# Altium schematic sheet AC-DC_Converter_Box.SchDoc
size Letter; DocumentNumber: 1; SheetNumber: 1; SheetTotal: 1
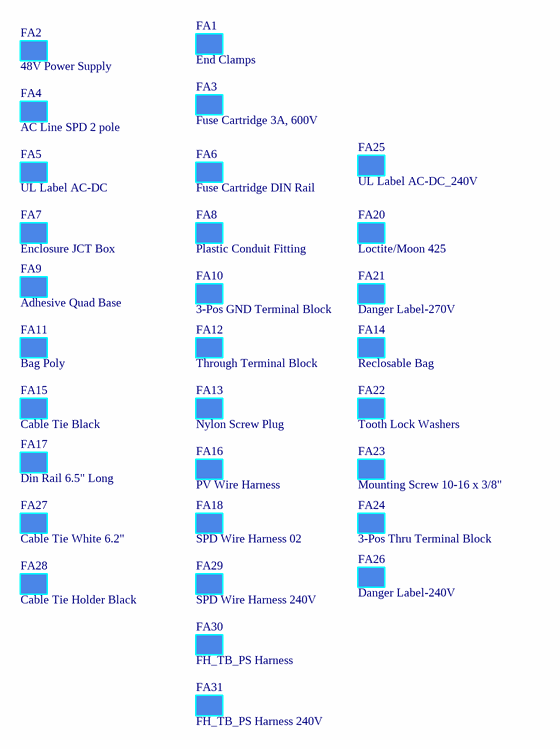
[diagram p0: AC-DC_Converter_Box.SchDoc]

## Parts
FA1  End Clamps  (mechanical)
FA2  48V Power Supply  (mechanical)
FA3  Fuse Cartridge 3A, 600V
FA4  AC Line SPD 2 pole  (mechanical)
FA5  UL Label AC-DC  (mechanical)
FA6  Fuse Cartridge DIN Rail
FA7  Enclosure JCT Box  (mechanical)
FA8  Plastic Conduit Fitting  (mechanical)
FA9  Adhesive Quad Base  (mechanical)
FA10  3-Pos GND Terminal Block  (mechanical)
FA11  Bag Poly  (mechanical)
FA12  Through Terminal Block  (mechanical)
FA13  Nylon Screw Plug
FA14  Reclosable Bag
FA15  Cable Tie Black
FA16  PV Wire Harness  (mechanical)
FA17  Din Rail 6.5" Long  (mechanical)
FA18  SPD Wire Harness 02  (mechanical)
FA20  Loctite/Moon 425  (mechanical)
FA21  Danger Label-270V  (mechanical)
FA22  Tooth Lock Washers  (mechanical)
FA23  Mounting Screw 10-16 x 3/8"  (mechanical)
FA24  3-Pos Thru Terminal Block  (mechanical)
FA25  UL Label AC-DC_240V  (mechanical)
FA26  Danger Label-240V  (mechanical)
FA27  Cable Tie White 6.2"  (mechanical)
FA28  Cable Tie Holder Black  (mechanical)
FA29  SPD Wire Harness 240V  (mechanical)
FA30  FH_TB_PS Harness
FA31  FH_TB_PS Harness 240V

## Notes on the sheet
- ---UNLESS OTHERWISE NOTED ---
  1. All resistors and capacitors are 0603 package.
  2. All resistor tolerances are 1%.
- Design
- Size
- Date
- Page
- Revision
- Time
- Sheet
- Author
- of
- File

## Library data of the parts
FA1 = FA,End Clamps: End Clamp for use with Phoenix DIN Rail Terminal Blocks, E/NS; MFR1: Phoenix Contact; MPN1: 800886; GCS PN: PRTCF00141-0886A; QTY: 2
FA2 = FA,48V Power Supply: Power Supplies - DIN Rail Mount 120W 48V 0-2.5A 85-305Vac Screw Terminal, Slim 30mm casing, 200% Peak Power, ITE 62368-1, Industrial 61558-1/-2-16, 61010, Marine DNV, SEMI47, HazLoc approved; MFR1: Mean Well; MPN1: XDR-120-48; GCS PN: CMPSF00470-4825A; MFR2: Mean Well; MPN2: XDR-120-48LA; QTY: 1
FA3 = FA,Fuse Cartridge,3A,600V: FUSE CARTRIDGE 3A 600VAC 5AG; MFR1: Littelfuse Inc.; MPN1: 0KLQ003.T; GCS PN: FSECF00508-KLQ3A; QTY: 2
FA4 = FA,AC Line SPD 2 pole: SPD TYPE 2 350VAC MCOV 2 POLE; MFR1: WEIDMÜLLER; MPN1: 2730640000; GCS PN: PRTSF00477-SPD2A; QTY: 1
FA5 = FA,UL Label AC-DC: UL Product Label for AC-DC Box; MFR1: Approved Vendor; MPN1: TBD; GCS PN: LABSF00503-ULACA; QTY: 1
FA6 = FA,Fuse Cartridge,DIN Rail: Fuse Holder 30 A 600V 2 Circuit Cartridge DIN Rail; MFR1: Littelfuse Inc.; MPN1: LPSM0002Z; GCS PN: FSEHF00511-LP02A; QTY: 1
FA7 = FA,Enclosure_JCT Box: IP66 Weatherproof junction box gray; MFR1: PolyCase; MPN1: HP-070705-21; GCS PN: ENCBF00498-1402A; QTY: 1
FA8 = FA,Plastic Conduit Fitting: Conduit Fitting: Plastic, 3/4 in Trade Size, Straight, Non-Insulated; MFR1: BRIDGEPORT FITTINGS; MPN1: 431-PLT; GCS PN: CONCF00510-431PA; QTY: 2
FA9 = FA,Adhesive Quad Base: Self-adhesive plastic base for cable ties Quad Opening Cable Tie Holder Transparent Adhesive, Screw.; MFR1: Allied Electronics & Automation; MPN1: 70253249; GCS PN: MC058; QTY: 5
FA10 = FA,3-Pos Gnd Terminal Block: Terminal Block Connector 3 Position Ground, Earth Green, Yellow 6-20 AWG; MFR1: WAGO Corporation; MPN1: 2216-1307; GCS PN: TERCF00486-1307A; QTY: 1
FA11 = FA,Bag Poly: MFR1: VICTORY PACKAGING; MPN1: BAG POLY PINK 3X5X.002; GCS PN: BAGPF00004-3X5PA; MFR2: (Open Source); MPN2: (Open Source); QTY: 1
FA12 = FA,Through Terminal Block: Terminal Block Connector 3 Position Feed Through Gray 6-20 AWG; MFR1: WAGO Corporation; MPN1: 2216-1301; GCS PN: TERCF00485-1301A; QTY: 1
FA13 = FA,Nylon Screw Plug: MFR1: Beisit; MPN1: SPG3410B; GCS PN: CABPF00489-3410A; QTY: 2
FA14 = FA,Reclosable Bag: 4 x 5" 2 Mil Reclosable Bags; MFR1: Uline; MPN1: S-3460; GCS PN: BAGZF00501-4500A; QTY: 1; MFR2: Open Source; MFR3: Open Source
FA15 = FA,Cable Tie Black: Cable tie, black, 4 inch, 100-pack, Standard, Locking Black 0.75" (19.05mm) 0.118" (3.00mm) 18 lbs (8.16 kg) 0.342' (104.24mm, 4.10"); MFR1: Buycableties.com; MPN1: 3M115BKC-ND; GCS PN: MC218; MFR2: (Open Source); MPN2: (Open Source); QTY: 5
FA16 = FA,PV Wire Harness: PV Wire Harness. Wire Harness for PV Wires.; MFR1: Parko PV; MPN1: ACD-PVW01; GCS PN: ACD-PVW01; QTY: 1
FA17 = FA,Din Rail 6.5": Din-Rail, cut to 6.5" lenght; MFR1: Phoenix Contact; MPN1: 1207640; GCS PN: MNTRF00514-6500A; MFR2: Open Source; QTY: 1
FA18 = FA,SPD Wire Harness_02: SPD Wire Harness. Wire Harness from AC Terminal Blocks to SPDs.; MFR1: Approved Vendor; MPN1: ACD-SPD02; GCS PN: ACD-SPD02; QTY: 1
FA20 = FA,Loctite 425_Moon 425: Loctite 425 / Moon 425; MPN1: 135461; GCS PN: ADHLF00386-L425A; MFR1: Loctite; QTY: 1; MFR2: Yantai Moon New Material Technology Co., Ltd.; MPN2: Moon 425
FA21 = FA,Danger Label: Danger Label for AC-DC Box (External)-277V; MFR1: Approved Vendor; MPN1: LABDF00516-DNGRA; QTY: 1; GCS PN: LABDF00516-DNGRA
FA22 = FA,Tooth Lock Washer-Screw 10: 18-8 Stainless Steel External Tooth Lock Washers for Number 10 Screw Size, 0.195" ID, 0.41" OD; MFR1: Mc Master; MPN1: 95584A205; GCS PN: WSHSF00440-1810A; QTY: 2
FA23 = FA,Mounting Screw 10-16 x 3/8": 10-16 X 3/8 TYPE AB PHILLIPS PAN HEAD SCREW; MFR1: Fastenry; MPN1: 1006ABPP; GCS PN: SCWPF00513-1016A; QTY: 2; MFR2: Open Source
FA24 = FA,3-Pos Thru Terminal Block: 3-conductor through terminal block; with push-button; 16 mm²; with test port; side and center marking; for DIN-rail 35 x 15 and 35 x 7.5; Push-in CAGE CLAMP®; 16,00 mm²; black; MFR1: WAGO Corporation; MPN1: 2216-1305; GCS PN: WSHIF00491-1305A; QTY: 1; MFR2: WAGO Corporation; MPN2: TERCF00485-1301A (Optional)
FA25 = FA,UL Label AC-DC: AC-DC Converter cETLus Product Label (External)_240V-GC2034; MFR1: Approved Vendor; MPN1: TBD; GCS PN: LABSF00515-ULACA; QTY: 1
FA26 = FA,Danger Label: Danger Label for AC-DC Box (External)-240V; MFR1: Approved Vendor; MPN1: LABDF00517-DNGRA; QTY: 1; GCS PN: LABDF00517-DNGRA
FA27 = FA,Cable Tie White 6.2in: CBL TIE LOCKING NAT 50LB 6.20 in LONG.; MFR1: Panduit Corp; MPN1: PLT1.5S-C; GCS PN: MISTF00519-PLT1A; QTY: 2; MFR2: Open Source
FA28 = FA,Cable Tie Holder_Black: Cable Tie Mounts MB4A BLK UV MNTG BASE-5952 ADH; MFR1: HellermannTyton; MPN1: 151-00646; GCS PN: MISHF00518-1111A; QTY: 2; MFR2: TE Connectivity Raychem Cable Protection; MPN2: 608803-1
FA29 = FA,SPD Wire Harness_240V: SPD Wire Harness. Wire Harness from AC Terminal Blocks to SPDs. 240V; MFR1: Approved Vendor; MPN1: ACD-SPD02-240V; QTY: 1; GCS PN: ACD-SPD02-240V
FA30 = FA,FH_TB_PS Harness: Harness for fuse holders, terminal blocks and power supply.; MFR1: Approved Supplier; MPN1: ACD-FTP01; QTY: 1; GCS PN: ACD-FTP01
FA31 = FA,FH_TB_PS Harness_240V: Harness for fuse holders, terminal blocks and power supply. 240V.; MFR1: Approved Supplier; MPN1: ACD-FTP01-240V; QTY: 1; GCS PN: ACD-FTP01-240V